# Altium schematic sheet Fused_Inputs.SchDoc
size A4
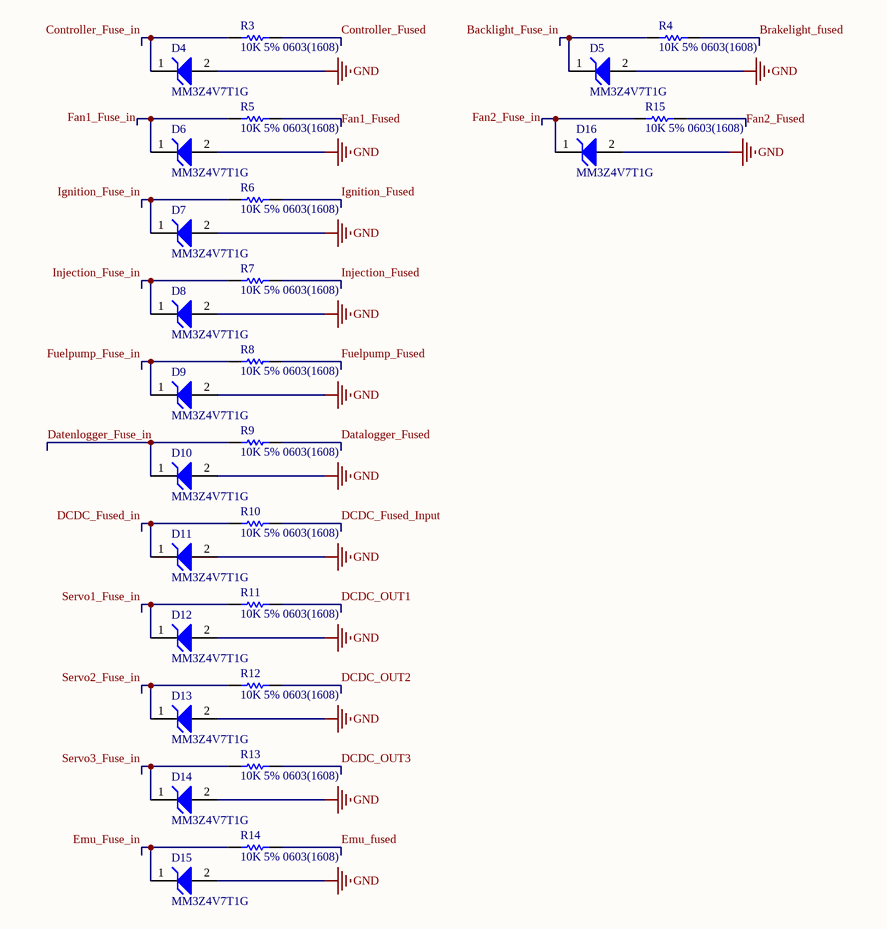
[diagram p0: Fused_Inputs.SchDoc]

## Parts
D4  MM3Z4V7T1G  [ONSC-SOD-323-2-477-02_V]
D5  MM3Z4V7T1G  [ONSC-SOD-323-2-477-02_V]
D6  MM3Z4V7T1G  [ONSC-SOD-323-2-477-02_V]
D7  MM3Z4V7T1G  [ONSC-SOD-323-2-477-02_V]
D8  MM3Z4V7T1G  [ONSC-SOD-323-2-477-02_V]
D9  MM3Z4V7T1G  [ONSC-SOD-323-2-477-02_V]
D10  MM3Z4V7T1G  [ONSC-SOD-323-2-477-02_V]
D11  MM3Z4V7T1G  [ONSC-SOD-323-2-477-02_V]
D12  MM3Z4V7T1G  [ONSC-SOD-323-2-477-02_V]
D13  MM3Z4V7T1G  [ONSC-SOD-323-2-477-02_V]
D14  MM3Z4V7T1G  [ONSC-SOD-323-2-477-02_V]
D15  MM3Z4V7T1G  [ONSC-SOD-323-2-477-02_V]
D16  MM3Z4V7T1G  [ONSC-SOD-323-2-477-02_V]
R3  10K 5% 0603(1608)  [RESC0603(1608)_N]
R4  10K 5% 0603(1608)  [RESC0603(1608)_N]
R5  10K 5% 0603(1608)  [RESC0603(1608)_N]
R6  10K 5% 0603(1608)  [RESC0603(1608)_N]
R7  10K 5% 0603(1608)  [RESC0603(1608)_N]
R8  10K 5% 0603(1608)  [RESC0603(1608)_N]
R9  10K 5% 0603(1608)  [RESC0603(1608)_N]
R10  10K 5% 0603(1608)  [RESC0603(1608)_N]
R11  10K 5% 0603(1608)  [RESC0603(1608)_N]
R12  10K 5% 0603(1608)  [RESC0603(1608)_N]
R13  10K 5% 0603(1608)  [RESC0603(1608)_N]
R14  10K 5% 0603(1608)  [RESC0603(1608)_N]
R15  10K 5% 0603(1608)  [RESC0603(1608)_N]

## Nets
GND: D4.2(A) D5.2(A) D6.2(A) D7.2(A) D8.2(A) D9.2(A) D10.2(A) D11.2(A) D12.2(A) D13.2(A) D14.2(A) D15.2(A) D16.2(A)
Backlight_Fuse_in: D5.1(K) R4.1
Brakelight_fused: R4.2
Controller_Fuse_in: D4.1(K) R3.1
Controller_Fused: R3.2
Datalogger_Fused: R9.2
Datenlogger_Fuse_in: D10.1(K) R9.1
DCDC_Fused_in: D11.1(K) R10.1
DCDC_Fused_Input: R10.2
DCDC_OUT1: R11.2
DCDC_OUT2: R12.2
DCDC_OUT3: R13.2
Emu_Fuse_in: D15.1(K) R14.1
Emu_fused: R14.2
Fan1_Fuse_in: D6.1(K) R5.1
Fan1_Fused: R5.2
Fan2_Fuse_in: D16.1(K) R15.1
Fan2_Fused: R15.2
Fuelpump_Fuse_in: D9.1(K) R8.1
Fuelpump_Fused: R8.2
Ignition_Fuse_in: D7.1(K) R6.1
Ignition_Fused: R6.2
Injection_Fuse_in: D8.1(K) R7.1
Injection_Fused: R7.2
Servo1_Fuse_in: D12.1(K) R11.1
Servo2_Fuse_in: D13.1(K) R12.1
Servo3_Fuse_in: D14.1(K) R13.1

## Library data of the parts
D4-D16 = CMP-1060-00657-1: Zener Voltage Regulator, 300 mW, 2-Pin SOD-323, Pb-Free, Tape and Reel; Manufacturer: On Semiconductor; VZ Typ (V): 4.7; P Max (W): 0.3; ComponentLink1Description: Manufacturer URL; PackageVersion: Rev. H, 03/2007; RoHS: Pb-Free; PackageReference: SOD-323-2-477-02; DatasheetVersion: Rev. 9; ComponentLink1URL: http://www.onsemi.com/; ComponentLink2Description: Datasheet; PartNumber: MM3Z4V7T1G; Mounting Technology: Surface Mount; ComponentLink2URL: http://www.onsemi.cn/pub_link/Collateral/MM3Z2V4T1-D.PDF; PackageDescription: 2-Pin SOD, Body 1.7 x 1.25 mm; Packing: Tape and Reel; ComponentLink3Description: Package Specification; ComponentLink3URL: http://www.onsemi.com/pub_link/Collateral/477-02.PDF.1
R3-R15 = CMP-1012-00098-1: 10K 0.1W 5% 0603 (1608 Metric)  SMD; Case-EIA: 0603; Value: 10000.00 Ohm; Case-Metric: 1608; Technology: SMT; Tolerance: 5 %; Power: 0.1 W